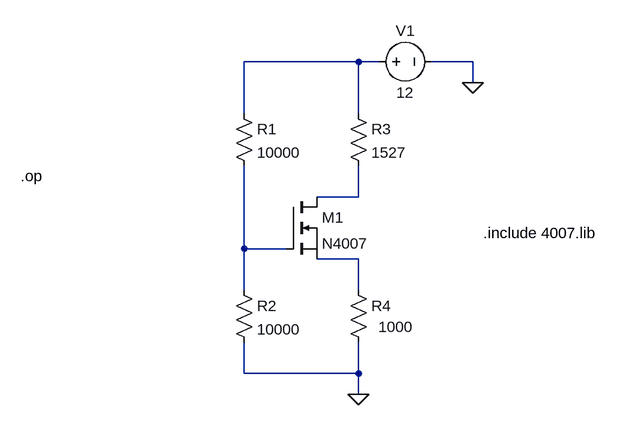
[diagram p0: schematic Draft3.asc]
Draft3.asc, the LTspice schematic file:
Version 4
SHEET 1 1072 680
WIRE 256 64 80 64
WIRE 288 64 256 64
WIRE 432 64 368 64
WIRE 432 96 432 64
WIRE 80 144 80 64
WIRE 256 144 256 64
WIRE 256 272 256 224
WIRE 256 272 192 272
WIRE 80 352 80 224
WIRE 144 352 80 352
WIRE 256 368 192 368
WIRE 80 416 80 352
WIRE 256 416 256 368
WIRE 80 544 80 496
WIRE 256 544 256 496
WIRE 256 544 80 544
WIRE 256 576 256 544
FLAG 432 96 0
FLAG 256 576 0
SYMBOL voltage 272 64 R270
WINDOW 0 32 56 VTop 2
WINDOW 3 -32 56 VBottom 2
WINDOW 123 0 0 Left 0
WINDOW 39 0 0 Left 0
SYMATTR InstName V1
SYMATTR Value 12
SYMBOL res 64 128 R0
SYMATTR InstName R1
SYMATTR Value 10000
SYMBOL res 64 400 R0
SYMATTR InstName R2
SYMATTR Value 10000
SYMBOL res 240 128 R0
SYMATTR InstName R3
SYMATTR Value 1527
SYMBOL res 240 400 R0
WINDOW 3 47 72 Left 2
SYMATTR InstName R4
SYMATTR Value 1000
SYMBOL nmos 144 272 R0
SYMATTR InstName M1
SYMATTR Value N4007
TEXT 448 328 Left 2 !.include 4007.lib
TEXT -264 240 Left 2 !.op

The netlist it stands for:
* Draft3.asc
V1 N001 0 12
R1 N001 N003 10000
R2 N003 0 10000
R3 N001 N002 1527
R4 N004 0 1000
M1 N002 N003 N004 N004 N4007
.model NMOS NMOS
.model PMOS PMOS
.lib standard.mos
.include 4007.lib
.op
.backanno
.end